# Altium schematic sheet Sheet1.SchDoc
size A4; SheetNumber: 14; SheetTotal: 14
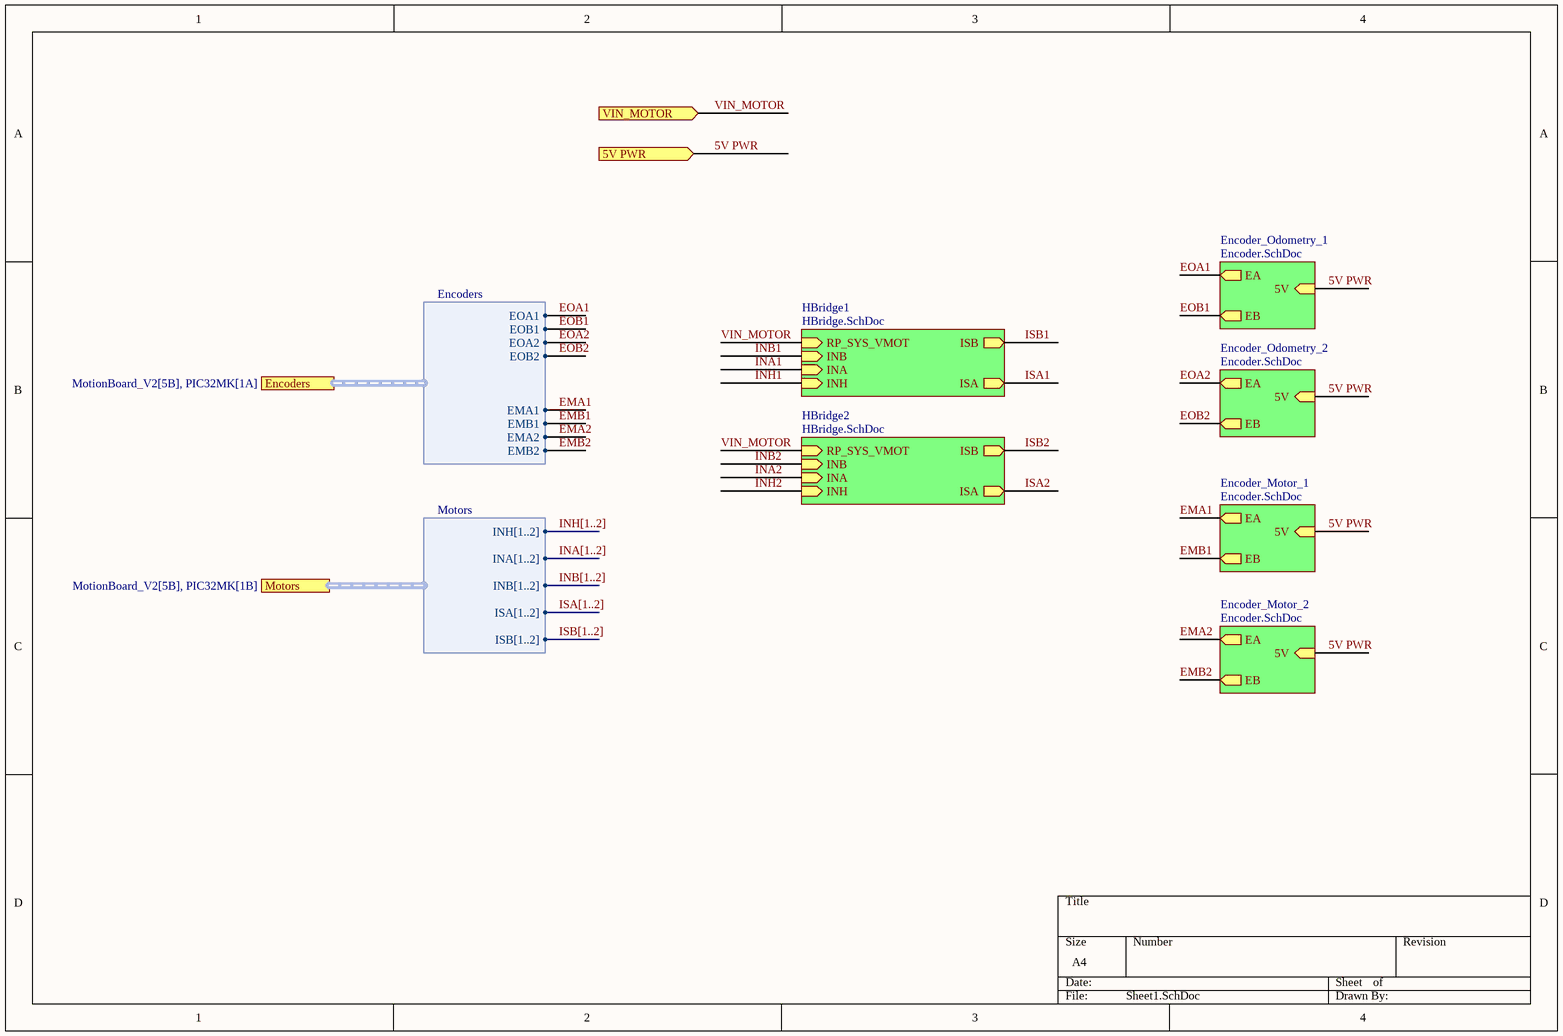
[diagram p0: Sheet1.SchDoc]

## Sub-sheets
Encoder_Motor_1 = Encoder.SchDoc: EB (out), EA (out), 5V (in)
Encoder_Motor_2 = Encoder.SchDoc: EB (out), EA (out), 5V (in)
Encoder_Odometry_1 = Encoder.SchDoc: EB (out), EA (out), 5V (in)
Encoder_Odometry_2 = Encoder.SchDoc: EB (out), EA (out), 5V (in)
HBridge1 = HBridge.SchDoc: RP_SYS_VMOT (in), INB (in), ISB (out), ISA (out), INA (in), INH (in)
HBridge2 = HBridge.SchDoc: RP_SYS_VMOT (in), INB (in), ISB (out), ISA (out), INA (in), INH (in)

## Ports
5V PWR (in), Encoders (harness Encoders, see MotionBoard_V2[5B], PIC32MK[1A]), Motors (harness Motors, see MotionBoard_V2[5B], PIC32MK[1B]), VIN_MOTOR (in)

## Harnesses
Encoders: EOA1, EOB1, EOA2, EOB2, EMA1, EMB1, EMA2, EMB2
Motors: INH[1..2], INA[1..2], INB[1..2], ISA[1..2], ISB[1..2]

## Nets
5V PWR: port 5V PWR, sheet Encoder_Odometry_2/5V, sheet Encoder_Motor_1/5V, sheet Encoder_Odometry_1/5V, sheet Encoder_Motor_2/5V
EMA1: sheet Encoder_Motor_1/EA, port Encoders.EMA1
EMA2: sheet Encoder_Motor_2/EA, port Encoders.EMA2
EMB1: sheet Encoder_Motor_1/EB, port Encoders.EMB1
EMB2: sheet Encoder_Motor_2/EB, port Encoders.EMB2
EOA1: sheet Encoder_Odometry_1/EA, port Encoders.EOA1
EOA2: sheet Encoder_Odometry_2/EA, port Encoders.EOA2
EOB1: sheet Encoder_Odometry_1/EB, port Encoders.EOB1
EOB2: sheet Encoder_Odometry_2/EB, port Encoders.EOB2
INA1: sheet HBridge1/INA
INA2: sheet HBridge2/INA
INB1: sheet HBridge1/INB
INB2: sheet HBridge2/INB
INH1: sheet HBridge1/INH
INH2: sheet HBridge2/INH
ISA1: sheet HBridge1/ISA
ISA2: sheet HBridge2/ISA
ISB1: sheet HBridge1/ISB
ISB2: sheet HBridge2/ISB
VIN_MOTOR: port VIN_MOTOR, sheet HBridge1/RP_SYS_VMOT, sheet HBridge2/RP_SYS_VMOT

## Buses and harness runs
bus INA[1..2]
bus INB[1..2]
bus INH[1..2]
bus ISA[1..2]
bus ISB[1..2]